# EasyEDA Pro project Magmattic PCB_V2.eprj, schematic ADC_1
Board Name: 849ADC; Create Date: 2025-03-31; Page Name: P1; Project Name: Magmattic PCB_V2; Schematic Name: ADC_1; Update Date: 2025-03-31; Company: EasyEDA.com; Page Size: A4; Version: V1.0
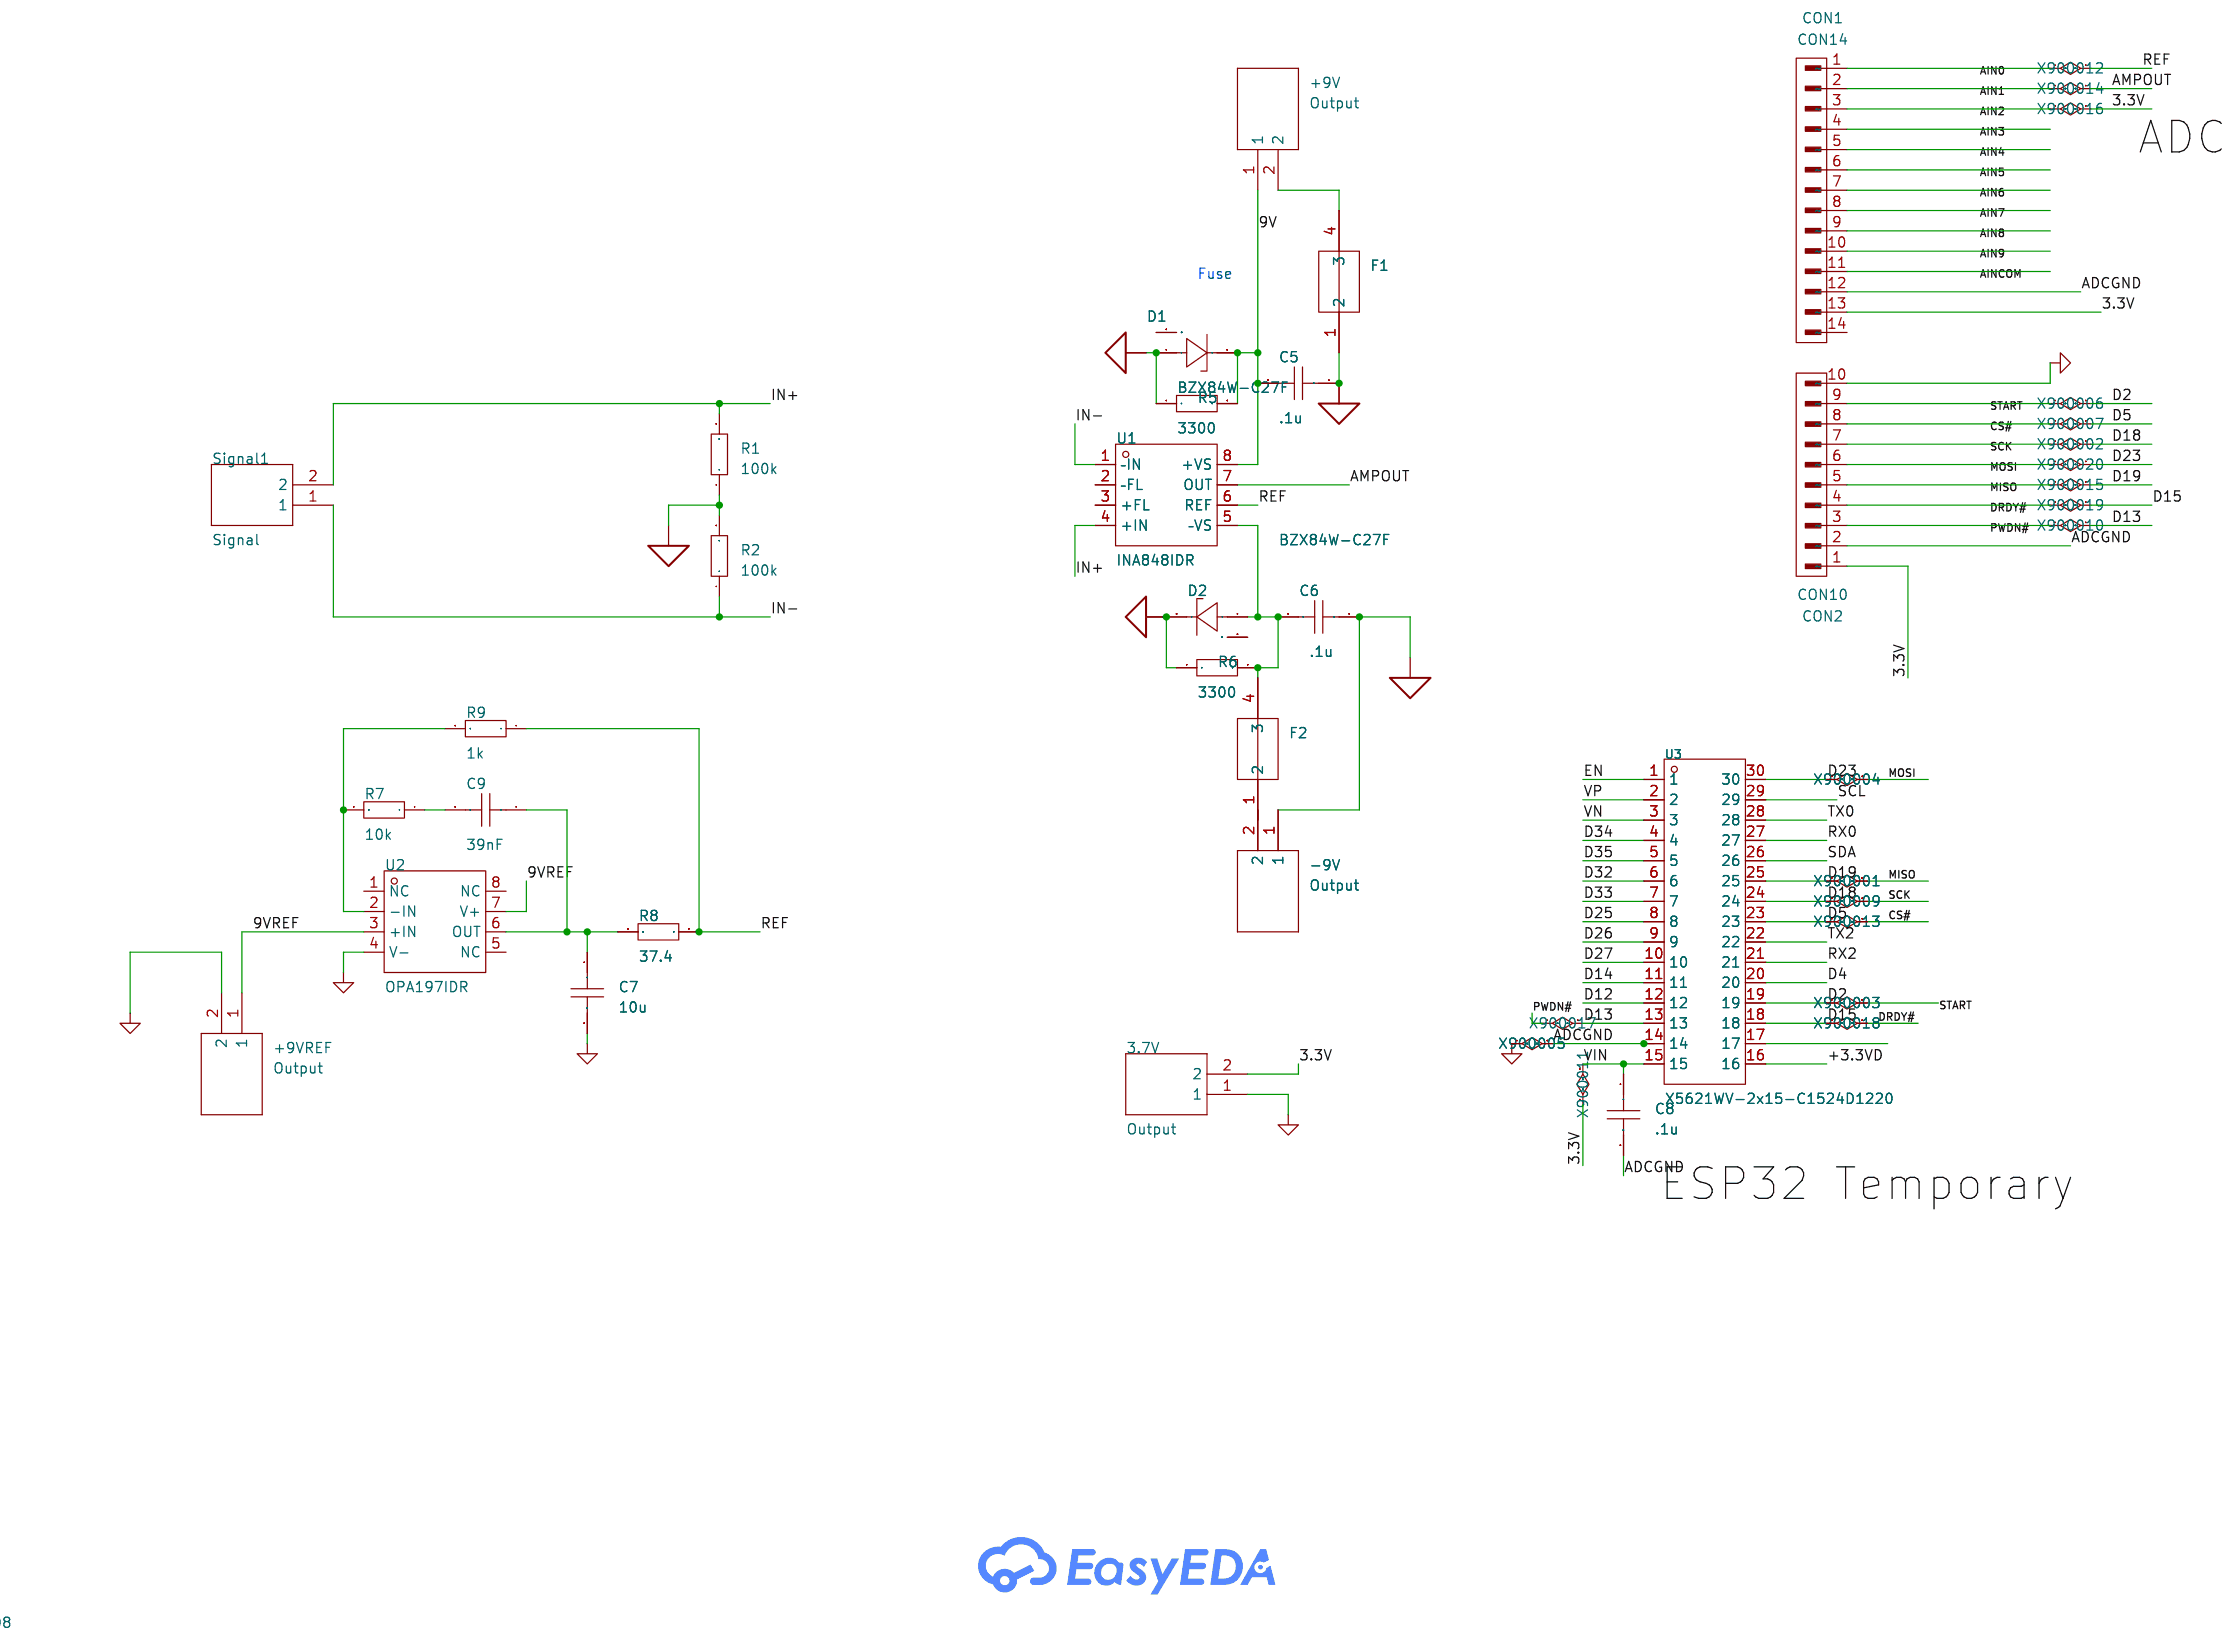
[diagram p4: schematic sheet]

## Parts
3.7V  Output  [CUI_TB002-500-02BE]
+9V  Output  [CUI_TB002-500-02BE]
+9VREF  Output  [CUI_TB002-500-02BE]
-9V  Output  [CUI_TB002-500-02BE]
C5  .1u  [C0603]
C6  .1u  [C0603]
C7  10u  [C0603]
C8  .1u  [C0603]
C9  39nF  [C0603]
CON1  CON14  [OLIMEX_Connectors-FP:HN1x13]
CON2  CON10  [OLIMEX_Connectors-FP:HN1x10]
D1  BZX84W-C27F  [SOT-323-3_L2.0-W1.3-P1.30-LS2.1-BR]
D2  BZX84W-C27F  [SOT-323-3_L2.0-W1.3-P1.30-LS2.1-BR]
F1  -  [10mA Fuse]
F2  -  [10mA Fuse]
R1  100k  [R0603]
R2  100k  [R0603]
R5  3300  [R0603]
R6  3300  [R0603]
R7  10k  [R0603]
R8  37.4  [R0603]
R9  1k  [R0603]
Signal1  Signal  [CUI_TB002-500-02BE]
U1  INA848IDR  [SOIC-8_L4.9-W3.9-P1.27-LS6.0-BL]
U2  OPA197IDR  [SOIC-8_L4.9-W3.9-P1.27-LS6.0-BL]
U3  X5621WV-2x15-C1524D1220  [ESP32]

## Library data of the parts
3.7V +9V +9VREF -9V Signal1 = TB002-500-02BE
C5-C9 = CAP_0603: Supplier Footprint: 0603
CON1 = BB-ADS1262-Rev.A_CON14
CON2 = BB-ADS1262-Rev.A_CON10
D1 D2 = BZX84W-C27F: Supplier Part: C551128; Manufacturer: Nexperia(安世); Supplier Footprint: SOT-323-3; JLCPCB Part Class: Extended Part; Datasheet: https://atta.szlcsc.com/upload/public/pdf/source/20240725/E6262E2E8B4D52267EA63ABF1EAAA53A.pdf; Supplier: LCSC; Zener Voltage (Nom): 27V; Reverse Leakage Current (Ir): 50nA@18.9V; Power Dissipation: 275mW; Zener Impedance (Zzt): 80Ω
F1 F2 = 10mA Fuse
R1 R2 R5-R9 = Res_0603: Supplier Footprint: 0603
U1 = INA848IDR: Supplier Part: C2866115; Manufacturer: TI(德州仪器); Supplier Footprint: SOIC-8; JLCPCB Part Class: Extended Part; Datasheet: https://www.ti.com/cn/lit/gpn/ina848; Supplier: LCSC
U2 = OPA197IDR: Supplier Part: C79274; Manufacturer: TI(德州仪器); Supplier Footprint: SOIC-8; JLCPCB Part Class: Extended Part; Datasheet: https://www.ti.com/cn/lit/gpn/opa197; Supplier: LCSC; Number of Circuits: Single channel; Gain Bandwidth Product(GBP): 10MHz; Current - Input Bias(Ib): 5pA; Slew Rate(SR): 20V/us; Operating Temperature: -40℃~+125℃
U3 = X5621WV-2x15-C1524D1220: LCSC Part Name: 间距2.54mm P数:30P 圆孔; Supplier Part: C2883626; Manufacturer: XKB Connectivity(中国星坤); Supplier Footprint: DIP-30; JLCPCB Part Class: Extended Part; Datasheet: https://atta.szlcsc.com/upload/public/pdf/source/20211009/52E47CAE713BD2A98F9718C005FE9F26.pdf; Supplier: LCSC; IC Type: DIP; Pitch: 2.54mm; Row Spacing: 15.24mm; Circular Holes/Square Holes: Circular Holes; Number of Positions: 30P; Operating Temperature Range: -40℃~+105℃

## Nets
3.3V: 3.7V.2 C8.1 CON1.3 CON1.13 CON2.1 U3.15
9V: +9V.1 C5.2 D1.3(K) R5.2 U1.8(+VS)
9VREF: +9VREF.1 U2.3(+IN) U2.7(V+)
+3.3VD: U3.16
AIN0: CON1.1 R8.1 R9.1 U1.6(REF)
AIN1: CON1.2 U1.7(OUT)
AIN3: CON1.4
AIN4: CON1.5
AIN5: CON1.6
AIN6: CON1.7
AIN7: CON1.8
AIN8: CON1.9
AIN9: CON1.10
AINCOM: CON1.11
AMPGND: -9V.1 C5.1 C6.1 D1.1(A) D2.3(K) F1.1(2) R1.1 R2.2 R5.1 R6.1
BB-ADS1262-REV.A_GNDD: 3.7V.1 +9VREF.2 C7.2 C8.2 CON1.12 CON2.2 CON2.10 U2.4(V-) U3.14
CS#: CON2.8 U3.23
D2: CON2.9 U3.19
D4: U3.20
D12: U3.12
D13: CON2.3 U3.13
D14: U3.11
D15: CON2.4 U3.18
D18: CON2.7 U3.24
D19: CON2.5 U3.25
D23: CON2.6 U3.30
D25: U3.8
D26: U3.9
D27: U3.10
D32: U3.6
D33: U3.7
D34: U3.4
D35: U3.5
EN: U3.1
IN+: R1.2 Signal1.2 U1.4(+IN)
IN-: R2.1 Signal1.1 U1.1(–IN)
RX0: U3.27
RX2: U3.21
SCL: U3.29
SDA: U3.26
TX0: U3.28
TX2: U3.22
VN: U3.3
VP: U3.2
$1N833: +9V.2 F1.4(3)
$1N6194: -9V.2 F2.1(2)
$1N6250: C6.2 D2.1(A) F2.4(3) R6.2 U1.5(–VS)
$1N6970: R7.2 R9.2 U2.2(-IN)
$1N6974: C7.1 C9.1 R8.2 U2.6(OUT)
$1N7595: C9.2 R7.1

Not connected (* = marked no-connect by the designer): CON1 14; D1 2(NC); D2 2(NC); U1 2(–FL) 3(+FL); U2 1(NC) 5(NC) 8(NC); U3 17

## Notes on the sheet
- ADC
- Fuse
- ESP32 Temporary
